# Altium schematic sheet traintrackr_schematic.SchDoc
size A4; SheetNumber: 1; SheetTotal: 2; SPICEModelCacheQDKCCJKJ: <root> / <DocumentId>QDKCCJKJ</DocumentId> / <CacheFrame Number="0"> / <Model Name="led1" Kind="MDL"> / <Text>*Typ RED GaAs LED: Vf=1.7V Vr=4V If=40mA trr=3uS / *LED Pinout: 1=A, 2=K / .MODEL LED1 D (IS=93.2P RS=42M N=3.73 BV=4 IBV=10U / + CJO=2.97P VJ=.75 M=.333 TT=4.32U)</Text> / </Model> / </CacheFrame> / </root>
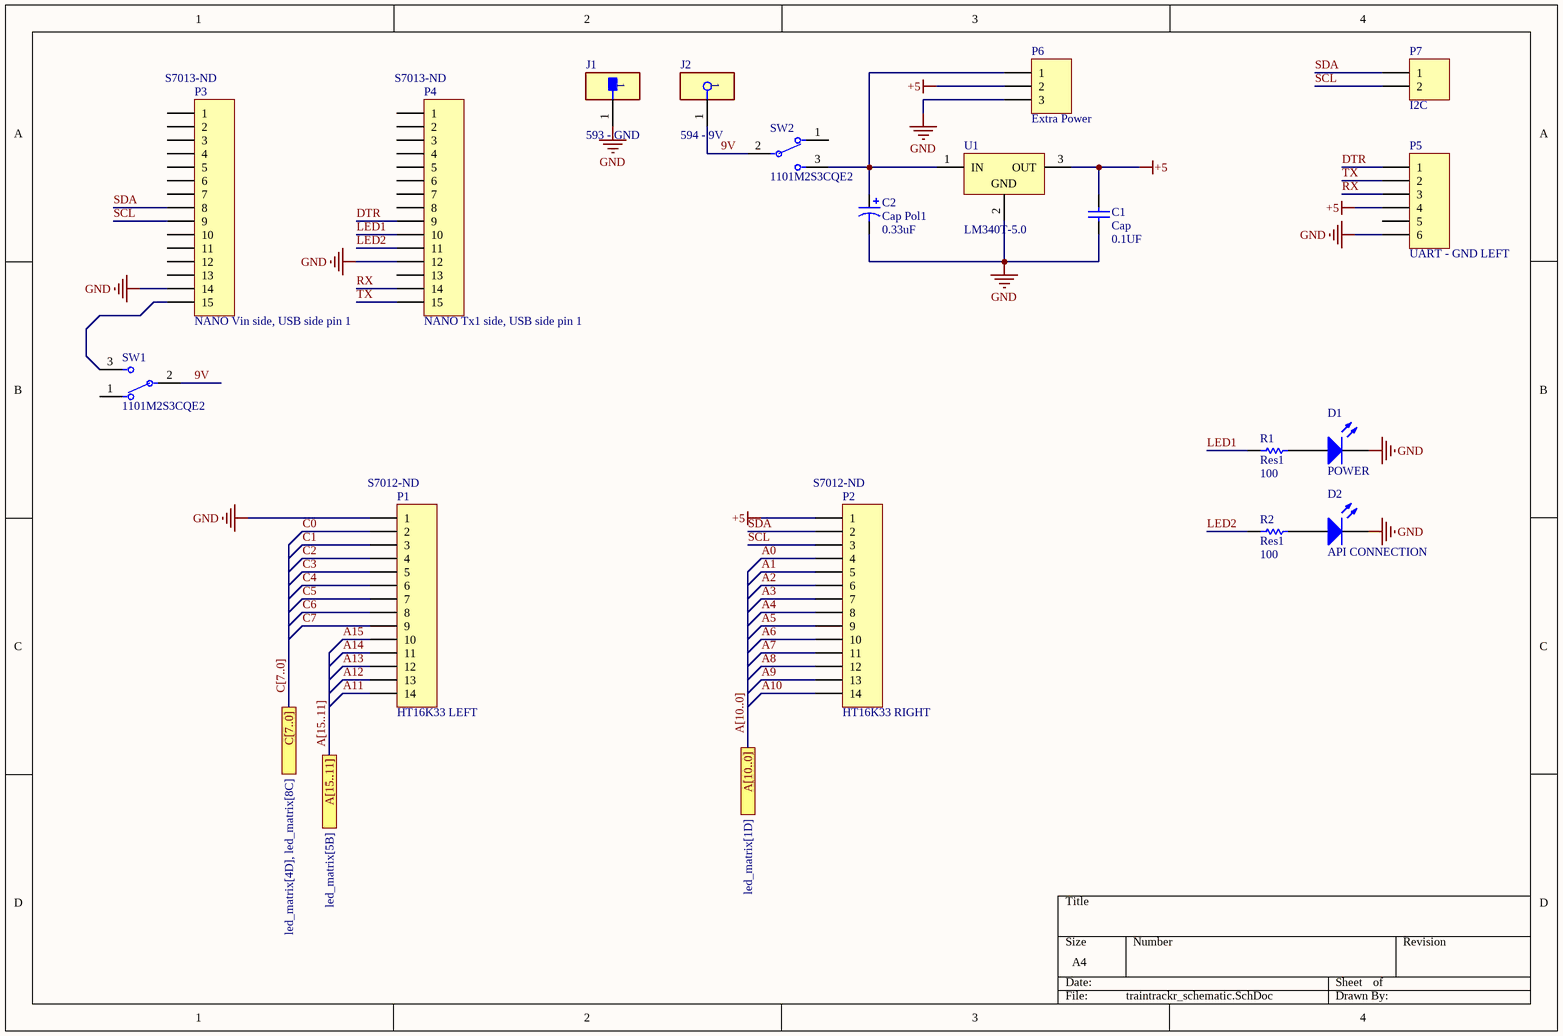
[diagram p0: traintrackr_schematic.SchDoc]

## Parts
C1  Cap  value 0.1UF  [RAD-0.1]
C2  Cap Pol1  value 0.33uF  [Capacitor 330nF]
D1  POWER  [LED_5MM]
D2  API CONNECTION  [LED_5MM]
J1  593 - GND  [FP-593-MFG]
J2  594 - 9V  [FP-594-MFG]
P1  HT16K33 LEFT  Supplier Part Number 1: S7012-ND  [HDR1X14]
P2  HT16K33 RIGHT  Supplier Part Number 1: S7012-ND  [HDR1X14]
P3  NANO Vin side, USB side pin 1  Supplier Part Number 1: S7013-ND  [HDR1X15]
P4  NANO Tx1 side, USB side pin 1  Supplier Part Number 1: S7013-ND  [HDR1X15]
P5  UART - GND LEFT  [HDR1X6H]
P6  Extra Power  [HDR1X3]
P7  I2C  [RAD-0.1]
R1  Res1  value 100  [AXIAL-0.3]
R2  Res1  value 100  [AXIAL-0.3]
SW1  1101M2S3CQE2  [FP-1101M2S3CQE2-MFG]
SW2  1101M2S3CQE2  [FP-1101M2S3CQE2-MFG]
U1  LM340T-5.0  [NDE0003A]

## Ports
A[10..0] (see led_matrix[1D]), A[15..11] (see led_matrix[5B]), C[7..0] (see led_matrix[4D], led_matrix[8C])

## Nets
+5: C1.2 P2.1 P5.4 P6.2 U1.3(OUT)
GND: C1.1 C2.2 D1.2(K) D2.2(K) J1.1 P1.1 P3.14 P4.12 P5.6 P6.3 U1.2(GND)
9V: J2.1 SW1.2(COMM) SW2.2(COMM)
A0: P2.4
A1: P2.5
A2: P2.6
A3: P2.7
A4: P2.8
A5: P2.9
A6: P2.10
A7: P2.11
A8: P2.12
A9: P2.13
A10: P2.14
A11: P1.14
A12: P1.13
A13: P1.12
A14: P1.11
A15: P1.10
C0: P1.2
C1: P1.3
C2: P1.4
C3: P1.5
C4: P1.6
C5: P1.7
C6: P1.8
C7: P1.9
DTR: P4.9 P5.1
LED1: P4.10 R1.1
LED2: P4.11 R2.1
RX: P4.14 P5.3
SCL: P2.3 P3.9 P7.2
SDA: P2.2 P3.8 P7.1
TX: P4.15 P5.2
NetC2_1: C2.1 P6.1 SW2.3 U1.1(IN)
NetD1_1: D1.1(A) R1.2
NetD2_1: D2.1(A) R2.2
NetP3_15: P3.15 SW1.3

Not connected (* = marked no-connect by the designer): P3 1 2 3 4 5 6 7 10 11 12 13; P4 1 2 3 4 5 6 7 8 13; P5 5; SW1 1; SW2 1

## Buses and harness runs
bus A[10..0] = port A[10..0]
bus A[15..11] = port A[15..11]
bus C[7..0] = port C[7..0]

## Library data of the parts
C1 = CAP CER 0.1UF 50V X7R RADIAL: Capacitor; Manufacturer Part Number: K104M15X7RF5TH5; Designator: C?; Voltage Rating: 50V; Published: 8-Jun-2000; LatestRevisionDate: 17-Jul-2002; LatestRevisionNote: Re-released for DXP Platform.; Publisher: Altium Limited
C2 = Cap Pol1: Polarized Capacitor (Radial); Published: 8-Jun-2000; LatestRevisionDate: 17-Jul-2002; LatestRevisionNote: Re-released for DXP Platform.; PackageReference: RB7.6-15; Publisher: Altium Limited; PackageDescription: Polarized Capacitor (Radial); 2 Leads
D1 D2 = LED1: Typical RED GaAs LED; Published: 8-Jun-2000; LatestRevisionDate: 08-Jul-2005; LatestRevisionNote: Mech Layer 1 removed.; PackageReference: LED-1; Publisher: Altium Limited; PackageDescription: LED; 2 Leads
J1 = CMP-19636-000031-1: BATTERY CONTACT SNAP 9V PC PIN; Body Material: Steel; Number of Batteries: 1; Material Thickness: 0.15inch; Gender: Male; Body Plating: Tin; Connector Type: Snap in; Thickness: 0.015inch; Contact Material: Steel; RoHS Compliant: Yes; Package Quantity: 100; Length: 9.65mm; Series: -; Packaging: Bulk; Reach SVHC Compliant: Yes; Contact Plating: Nickel; Lead Free: Lead Free; Termination: PC Pin; Mount: Through Hole; Orientation: Right Angle; Material: Steel; Number of Cells: 1; Contact Type: Snap-In
J2 = CMP-19636-000029-1: BATTERY CONTACT SNAP 9V PC PIN; Body Material: Steel; Material Thickness: 0.15inch; Connector Type: Snap in; Number of Cells: 1; Gender: Female; Body Plating: Tin; Package Quantity: 100; Termination: PC Pin; Thickness: 0.015inch; Reach SVHC Compliant: Yes; RoHS Compliant: Yes; Length: 9.65mm; Contact Plating: Nickel; Contact Type: Snap-In; Material: Steel; Packaging: Bulk; Orientation: Right Angle; Mount: Through Hole; Lead Free: Lead Free; Series: -; Number of Batteries: 1; Contact Material: Steel
P1 P2 = Header 14: Header, 14-Pin; LatestRevisionDate: 17-Jul-2002; LatestRevisionNote: Re-released for DXP Platform.; Publisher: Altium Limited; Supplier 1: Digi-Key
P3 P4 = Header 15: Header, 15-Pin; LatestRevisionDate: 17-Jul-2002; LatestRevisionNote: Re-released for DXP Platform.; Publisher: Altium Limited; Supplier 1: Digi-Key
P5 = Header 6H: Header, 6-Pin, Right Angle; LatestRevisionDate: 17-Jul-2002; LatestRevisionNote: Re-released for DXP Platform.; Publisher: Altium Limited; Supplier 1: Digi-Key; Supplier Part Number 1: S1111EC-06-ND
P6 = Header 3: Header, 3-Pin; LatestRevisionDate: 17-Jul-2002; LatestRevisionNote: Re-released for DXP Platform.; Publisher: Altium Limited; Supplier 1: Digi-Key; Supplier Part Number 1: 2057-PH1-20-UA-ND
P7 = Header 2H: Header, 2-Pin, Right Angle; LatestRevisionDate: 17-Jul-2002; LatestRevisionNote: Re-released for DXP Platform.; Publisher: Altium Limited; Supplier 1: Digi-Key; Supplier Part Number 1: 2057-PH1-20-UA-ND
R1 R2 = Res1: Resistor; Published: 8-Jun-2000; LatestRevisionDate: 17-Jul-2002; LatestRevisionNote: Re-released for DXP Platform.; PackageReference: AXIAL-0.3; Publisher: Altium Limited; PackageDescription: Axial Device, Thru-Hole; 2 Leads; 0.3 in Pin Spacing
SW1 SW2 = CMP-10038-000019-1: SWITCH SLIDE SPDT 6A 120V; Switch Travel: 2.16mm; Number of Positions: 3; Number of Poles: 1; Approvals: UL; Actuator Length: 5.08mm; Voltage Rating (DC): 28V; Max Voltage Rating (AC): 250V; Insulation Resistance: 1GR; Body Material: Stainless Steel; Actuator Type: Standard; Contact Resistance: 10mR; Switch Function: On-On; Actuator Material: Nylon; Actuator Color: Black; Electrical Life: 40000Cycles; Termination: PC Pins; Packaging: Bulk; Housing Material: Stainless Steel; Flammability Rating: UL94 V-0; Series: 1000; Contact Current Rating: 6A; Length: 12.7mm; Depth: 6.6mm; Orientation: Vertical; Max Current Rating: 6A; Max Operating Temperature: 65°C; Throw Configuration: SPDT; REACH SVHC: No SVHC; Contact Material: Copper; Max Voltage Rating (DC): 28V; Lead Free: Lead Free; Current Rating: 6A; Voltage Rating (AC): 120V; Contact Plating: Silver; Package Quantity: 1; Min Operating Temperature: -30°C; Mount: Through Hole
U1 = CMP-0062-02468-3: Series 3-Terminal Positive Regulators, 3-pin TO-220; Manufacturer: Texas Instruments; PowerWise: N; CompType: LDO IC; PackageTopMarking: NSUZXYTTE#*LM340T5*7805 P+; RoHS: N; ComponentLink1URL: http://www.ti.com/general/docs/lit/getliterature.tsp?genericPartNumber=LM340-N&fileType=pdf; PinCount: 3; PackageReference: NDE0003A; ComponentLink1Description: Datasheet URL; PackageDescription: TO-220, Molded, 3 Lead, Straight